# Altium schematic sheet 555_Astable.SchDoc
size A; SheetNumber: 2; SheetTotal: 2
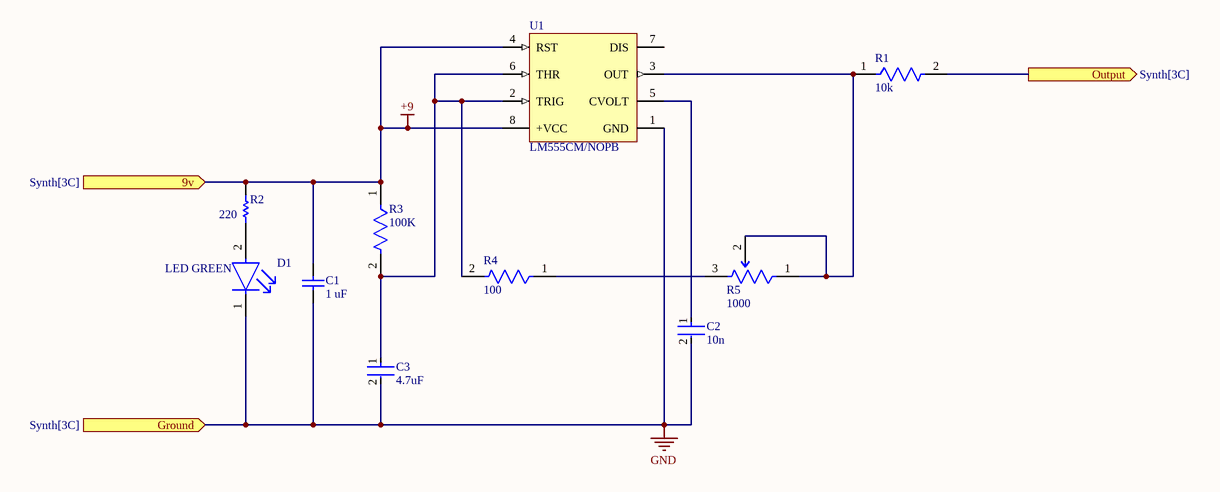
[diagram p0: 555_Astable.SchDoc]

## Parts
C1  1 uF  [CAPC3216X110X50LL20T25]
C2  10n  [FP-C0805C-DN-MFG]
C3  4.7uF  [FP-CL282-IPC_C]
D1  LED GREEN  [FP-LTST-C190GKT-MFG]
R1  10k  [FP-RT0603-MFG]
R2  220  [RESC3216X60X45ML10T20]
R3  100K  [FP-RC0603-0_55-MFG]
R4  100  [FP-ERJ1GN-MFG]
R5  1000  [FP-3362P-1-102TLF-MFG]
U1  LM555CM/NOPB  [D0008A_M]

## Ports
9v (in, see Synth[3C]), Ground (in, see Synth[3C]), Output (out, see Synth[3C])

## Nets
+9: C1.2 R2.1 R3.1 U1.4(RST) U1.8(+VCC) ; port 9v
GND: C1.1 C2.2 C3.2 D1.1(C) U1.1(GND) ; port Ground
Output: R1.2 ; port Output
NetC2_1: C2.1 U1.5(CVOLT)
NetC3_1: C3.1 R3.2 R4.2 U1.2(TRIG) U1.6(THR)
NetD1_2: D1.2(A) R2.2
NetR1_1: R1.1 R5.1(CCW) R5.2(WIPER) U1.3(OUT)
NetR4_1: R4.1 R5.3(CW)

Not connected (* = marked no-connect by the designer): U1 7(DIS)

## Library data of the parts
C1 = CMP-2000-06011-1: Chip Capacitor, 1 uF, +/- 10%, 50 V, -55 to 125 degC, 1206 (3216 Metric), RoHS, Tape and Reel; Manufacturer: Kemet; Case Height: 1mm; Dielectric: X7R; Voltage Rating: 50V; Capacitance: 1uF; Temperature Coefficient / Code: +/-15%; Case Length: 3.2mm; Case Width: 1.6mm; Type: SMDMLCCX7R6.3-250VDCCommericalGrade; Class: Class1; Capacitance - nF: 1000nF; Value: 1uF; Datasheet URL: http://www.kemet.com/docfinder?Partnumber=C1206C105K5RACTU; Product Category: MultilayerCeramicCapacitorsMLCC-SMD/SMT; Termination Style: SMD/SMT; Dimensions: 1.6mmWx3.2mmLx1mmH; Voltage Rating DC: 50V; Datasheet Version: 02/2016; Packaging: Reel; Brand: Kemet; RoHS: Details; Minimum Operating Temperature: -55C; Operating Temperature Range: -55Cto+125C; Package Reference: 1206; Manufacturer URL: http://www.kemet.com/; Product: GeneralTypeMLCCs; Tolerance: 10%; Package Description: 2-Pin Surface Mount Device, Body 3.2 x 1.6 mm; Mounting Technology: SurfaceMount; Case Code - mm: 3216; Maximum Operating Temperature: +125C; Series: C1206C; Factory Pack Quantity: 2500; Package / Case: 1206(3216metric); Case Code - in: 1206
C2 = CMP-2007-00259-2: CAP CER 10000PF 200V X7R 0805 C0805C103K2RACTU; Manufacturer: KEMET; Material: Ceramic; Temperature Coefficient: 30ppm/°C; Capacitance: 10,000 pF; Description: C0805 10,000 pF X7R 30ppm/°C 10.00% 200 V; Tolerance: 0.1; Value: 10,000 pF; Device Class L2: Capacitors; Voltage Rating: 200 V; Temperature Range High: +125°C; ComponentLink2Description: Datasheet; Height: 0.88mm; Octopart: https://octopart.com/c0805c103k2ractu-kemet-9138347; ComponentLink2URL: https://content.kemet.com/datasheets/KEM_C1003_C0G_SMD.pdf; Category: Cap; Temperature: -55°C to +125°C; Temperature Range Low: -55°C; Digikey Description: CAP CER 10000PF 200V X7R 0805; Manufacturer Part Number: C0805C103K2RACTU; Temperature Characteristic: X7R; Automotive: No; Device Class L3: Ceramic Capacitors; Mouser Description: KEMET - C0805C103K2RACTU - CAP, MLCC, X7R, 10NF, 200V, 0805; RoHS: TRUE; Device Class L1: Passive Components; Lead Free: Yes; Package: C0805C-DN; Ipc Land Pattern Name: CAPC200125X78
C3 = CMP-13271-000548-1: Cap Ceramic 4.7uF 10V X5R ±20% SMD 0402 +85°C Paper T/R 4.7uF CL05A475MP5NRNC; Capacitance: 4.7uF; Max Operating Temperature: 85°C; Lead Free: Lead Free; Tolerance: 20%; Voltage Rating: 10V; Dielectric: X5R; Width: 0.02inch; Length: 0.039inch; Case/Package: 0402; Min Operating Temperature: -55°C; Packaging: Tape and Reel; Thickness: 0.022inch; Case Code (Imperial): 0402; Package Quantity: 10000; Case Code (Metric): 1005; Mount: Surface Mount; Value: 4.7uF
D1 = CMP-22017-000005-2: LED GREEN CLEAR CHIP SMDLTST-C190GKT; Dominant Wavelength: 569nm; Reverse Voltage: 5V; Lens Color: Colorless; Viewing Angle: 130°; Voltage: 2V; Forward Current: 30mA; Power Dissipation: 100mW; Luminous Intensity: 6mcd; Number of LEDs: 1; Forward Voltage: 2.1V; Wavelength: 565nm; Test Current: 10mA; Min Operating Temperature: -55°C; Lens Style: Clear; Mount: Surface Mount; Width: 0.8mm; Packaging: Tape and Reel; Lens Transparency: Clear; Case Code (Metric): 1608; Depth: 0.8mm; Case Code (Imperial): 0603; Case/Package: 0603; Number of Pins: 2; Max Operating Temperature: 85°C; Lead Free: Lead Free; Number of Elements: 1; Length: 1.6mm; Height: 0.8mm; Package Quantity: 1; Power Rating: 100mW; Radiation Hardening: No; Illumination Color: Green; Color: Green
R1 = CMP-03412-005349-1: RES SMD 10K OHM 1% 1/10W 0603 RT0603FRE0710KL; Manufacturer: Yageo; Value: 10KΩ; Temperature Coefficient: 50 ppm/°C; Power Rating: 0.1W; Tolerance: 0.01; Description: RT0603 10KΩ 0.1W 50 ppm/°C 1.00%; Voltage Rating: 75V; RoHS: TRUE; Category: Res; Automotive: No; Digikey Description: RES SMD 10K OHM 1% 1/10W 0603; ComponentLink2Description: Datasheet; Octopart: https://octopart.com/rt0603fre0710kl-yageo-40009243; ComponentLink2URL: http://www.yageo.com/documents/recent/PYu-RT_1-to-0.01_RoHS_L_9.pdf; Device Class L3: Chip SMD Resistors; Device Class L1: Passive Components; Temperature Range High: +155°C; Height: 0.55mm; Composition: Thin Film; Ipc Land Pattern Name: RESC16080X45; Series: RT; Package: RT0603; Resistance: 10KΩ; Footprint Url: http://www.yageo.com/exep/pages/download/literatures/PYu-R_Mount_10.pdf; Temperature: -55°C to +155°C; Temperature Range Low: -55°C; Lead Free: Yes; Device Class L2: Resistors; Mouser Description: Thin Film Resistors - SMD 10K ohm 1% 1/10W; Manufacturer Part Number: RT0603FRE0710KL
R2 = CMP-2003-01956-1: CRCW1206220RFKEA; Manufacturer: Vishay Dale; Part Number: CRCW1206220RFKEA
R3 = CMP-2100-03662-2: RES SMD 100K OHM 1% 1/10W 0603 RC0603FR-07100KL; Voltage Rating (DC): 50V; Resistance: 100kR; Max Power Dissipation: 100mW; Temperature Coefficient: 100ppm/°C; Working Voltage: 75V; Value: 100kR; Length: 1.6mm; Lead Free: Lead Free; Number of Terminations: 2; Packaging: Tape and Reel; Voltage Rating: 50V; Termination: SMD/SMT; Width: 0.8mm; Resistor Type: Thick Film; Resistance Tolerance: 1%; Features: Moisture Resistant; Height: 0.45mm; Construction: Rectangular; Case/Package: 0603; Military Standard: Not; Case Code (Imperial): 0603; Series: RC; Technology: THICK FILM; Depth: 0.8mm; RoHS Compliant: Yes; REACH SVHC: No SVHC; Min Operating Temperature: -55°C; Case Code (Metric): 1608; Max Operating Temperature: 155°C; Power Rating: 100mW; Number of Pins: 2; Tolerance: 1%
R4 = CMP-2004-03443-2: RES SMD 100 OHM 1% 1/20W 0201ERJ-1GNF1000C; Manufacturer: Panasonic Electronic Components; Automotive Grade: Grade 1; Temperature Coefficient: 200ppm/°C; Description: Res Thick Film 0201 100 Ohm 1% 1/20W ±200ppm/°C Molded SMD Pressed Carrier T/R; Value: 100Ω; Power Rating: 0.05W; Voltage Rating: 25V; Height: 0.26mm; Series: ERJ; Category: Res; Device Class L3: Chip SMD Resistors; Octopart: https://octopart.com/erj-1gnf1000c-panasonic-55419695; ComponentLink2URL: https://industrial.panasonic.com/cdbs/www-data/pdf/RDA0000/AOA0000C304.pdf; Manufacturer Part Number: ERJ-1GNF1000C; Footprint Url: https://industrial.panasonic.com/cdbs/www-data/pdf/RDA0000/DMA0000COL17.pdf; Tolerance: 1%; Digikey Description: RES SMD 100 OHM 1% 1/20W 0201; Temperature Range Low: -55°C; Mouser Description: Thick Film Resistors 0201 100ohm 1% HalogenFree AEC-Q200; Temperature: -55°C to +125°C; Device Class L2: Resistors; Package: ERJ1GN; Lead Free: Yes; Resistance: 100Ω; Composition: Thick Film; Automotive: Yes; Temperature Range High: +125°C; Device Class L1: Passive Components; ComponentLink2Description: Datasheet; RoHS: TRUE
R5 = CMP-07234-000030-1: TRIMMER 1K OHM 0.5W PC PIN TOP 3362P-1-102TLF; Power Rating: 500mW; Tolerance: 10%; Resistance: 1kR; Number of Turns: 1; Temperature Coefficient: 100ppm/°C; Weight: 0.02oz; RoHS Compliant: Yes; Contact Plating: Tin; Mount: Through Hole; Max Operating Temperature: 125°C; Series: Trimpot® 3362 - Sealed; Packaging: Rail/Tube; Depth: 7.04mm; Resistor Type: Cermet; Length: 6.71mm; Width: 4.7mm; Max Power Dissipation: 500mW; Termination: Pin; Package Quantity: 200; Military Standard: Not; Technology: CERMET; Min Operating Temperature: -55°C; Height: 0.185inch
U1 = CMP-0056-00105-3: Timer, 8-pin Narrow SOIC, Pb-Free; Manufacturer: Texas Instruments; PowerWise: N; CompType: Analog IC; PackageTopMarking: NSZXTT*LM*555CM; PinCount: 8; PackageDescription: SOIC Narrow, 4.9 x 3.9 x 1.45mm, 8 Lead, 1.27mm Pitch; RoHS: Y; ComponentLink1Description: Datasheet URL; ComponentLink1URL: http://www.ti.com/general/docs/lit/getliterature.tsp?genericPartNumber=LM555&fileType=pdf; PackageReference: D0008A; Code_JEDEC: MS-012-AA; Code_IPC: SOIC127P600-8